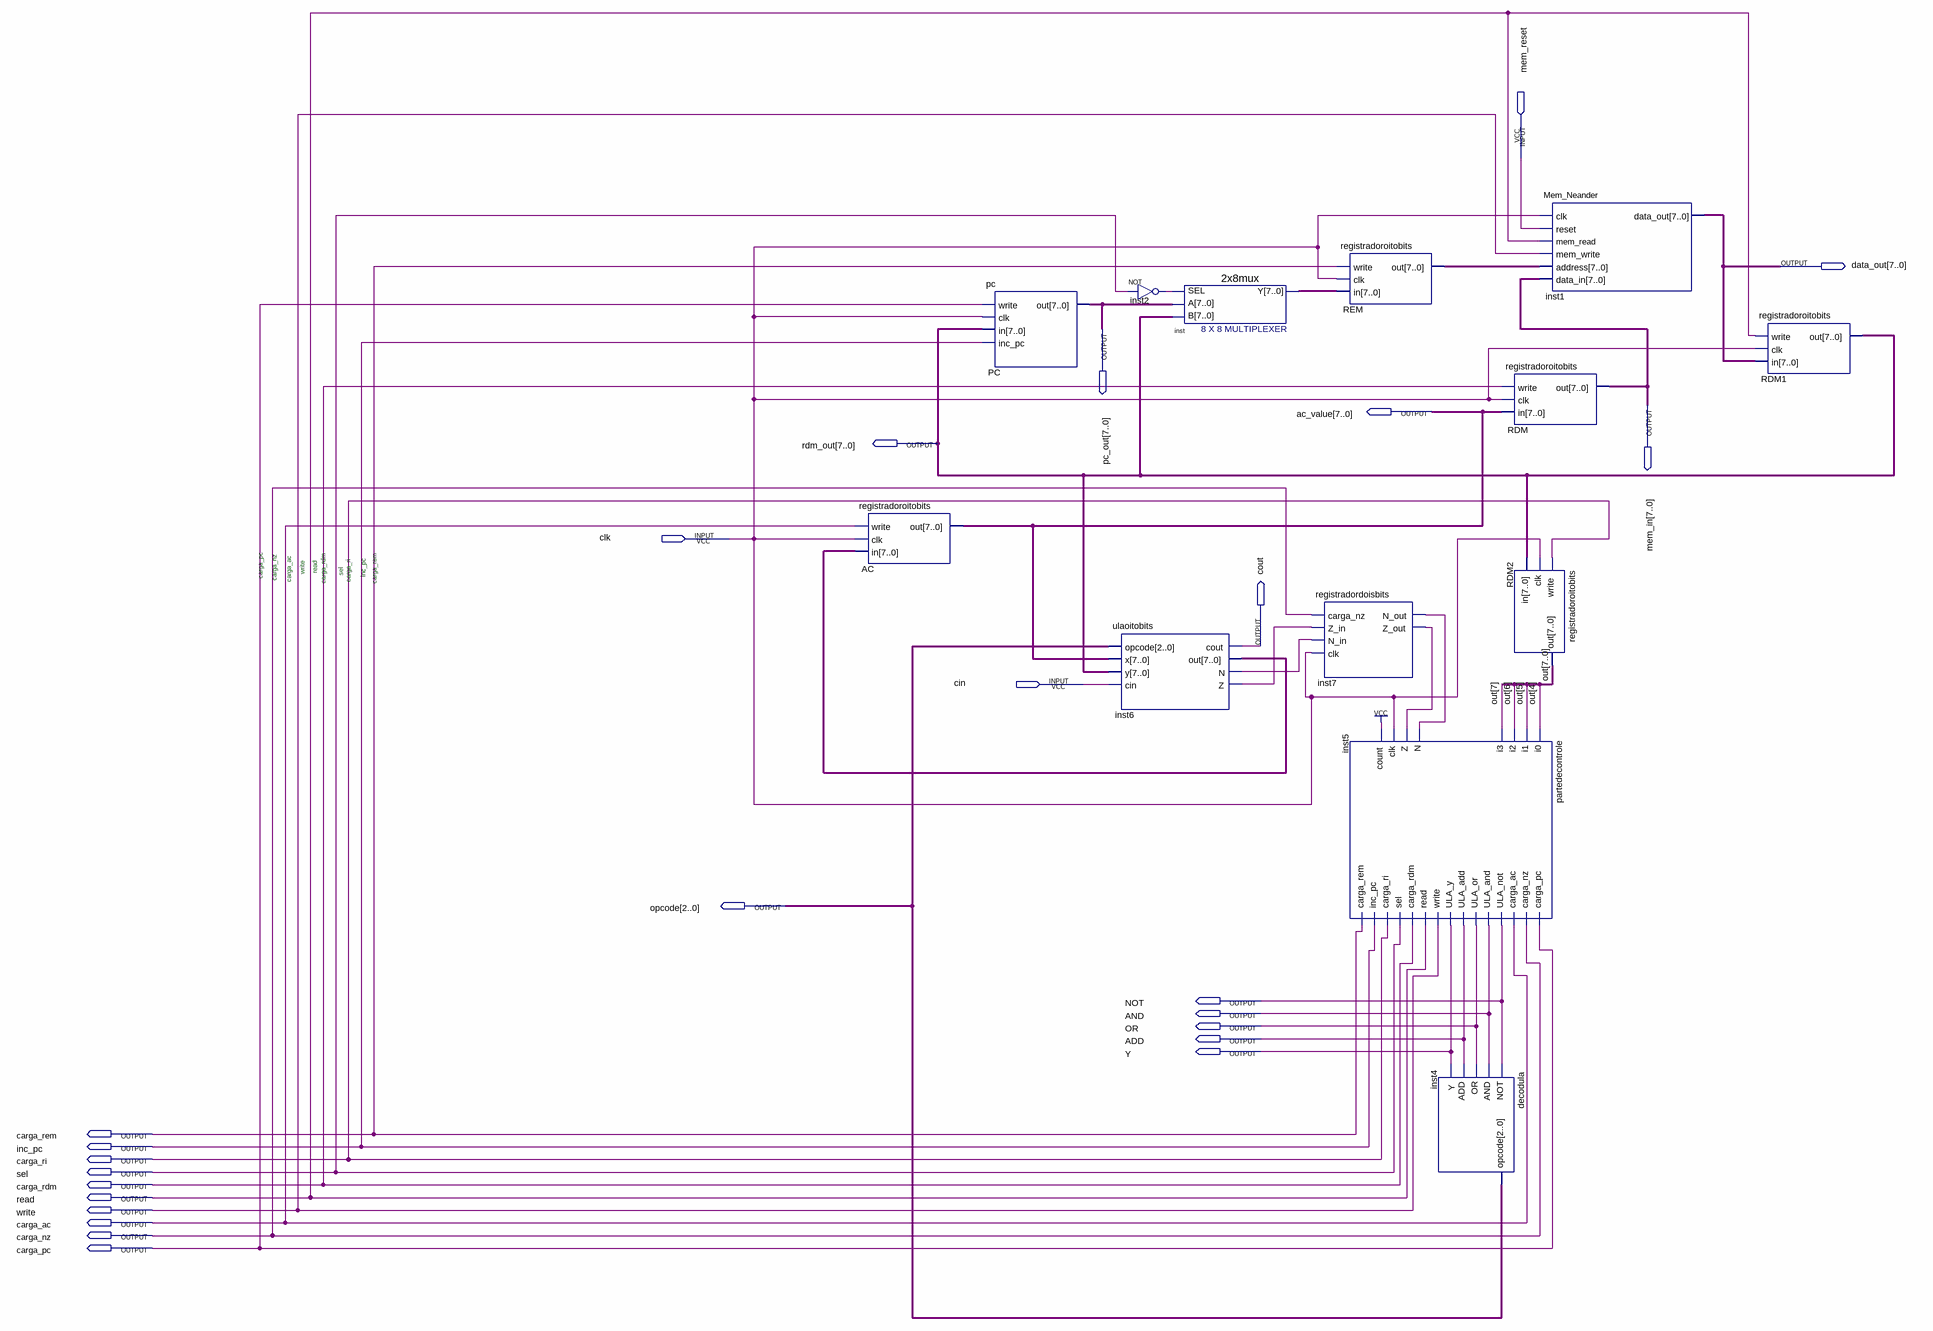
[diagram p0: schematic sheet]
// Quartus schematic parteoperativa.bdf as structural Verilog: 13 symbols, 25 pins
module parteoperativa (
  input  mem_reset,
  input  clk,
  input  cin,
  output [7:0] data_out,
  output [7:0] pc_out,
  output [7:0] mem_in,
  output [7:0] ac_value,
  output [7:0] rdm_out,
  output cout,
  output [2:0] opcode,
  output NOT,
  output AND,
  output OR,
  output ADD,
  output Y,
  output carga_rem,
  output inc_pc,
  output carga_ri,
  output sel,
  output carga_rdm,
  output read,
  output write,
  output carga_ac,
  output carga_nz,
  output carga_pc
);

  wire inst2_out, inst6_n, inst6_z, inst7_n_out, inst7_z_out;
  wire [7:0] inst6_out, inst_y, out, REM_out;

  registradoroitobits AC (.write(carga_ac), .clk(clk), .in(inst6_out), .out(ac_value));
  pc PC (.write(carga_pc), .clk(clk), .in(rdm_out), .inc_pc(inc_pc), .out(pc_out));
  not inst2 (inst2_out, sel);
  ulaoitobits inst6 (
    .opcode(opcode), .x(ac_value), .y(rdm_out), .cin(cin), .cout(cout), .out(inst6_out), .N(inst6_n),
    .Z(inst6_z));
  \2x8mux  inst (.SEL(inst2_out), .A(pc_out), .B(rdm_out), .Y(inst_y));
  registradoroitobits REM (.write(carga_rem), .clk(clk), .in(inst_y), .out(REM_out));
  registradordoisbits inst7 (
    .carga_nz(carga_nz), .Z_in(inst6_z), .N_in(inst6_n), .clk(clk), .N_out(inst7_n_out), .Z_out(inst7_z_out));
  partedecontrole inst5 (
    .i0(out[4]), .i1(out[5]), .i2(out[6]), .i3(out[7]), .N(inst7_n_out), .Z(inst7_z_out), .clk(clk),
    .count(1'b1), .carga_pc(carga_pc), .carga_nz(carga_nz), .carga_ac(carga_ac), .ULA_not(NOT),
    .ULA_and(AND), .ULA_or(OR), .ULA_add(ADD), .ULA_y(Y), .write(write), .read(read), .carga_rdm(carga_rdm),
    .sel(sel), .carga_ri(carga_ri), .inc_pc(inc_pc), .carga_rem(carga_rem));
  decodula inst4 (.AND(AND), .OR(OR), .NOT(NOT), .Y(Y), .ADD(ADD), .opcode(opcode));
  Mem_Neander inst1 (
    .clk(clk), .reset(mem_reset), .mem_read(read), .mem_write(write), .address(REM_out), .data_in(mem_in),
    .data_out(data_out));
  registradoroitobits RDM (.write(carga_rdm), .clk(clk), .in(ac_value), .out(mem_in));
  registradoroitobits RDM2 (.write(carga_ri), .clk(clk), .in(rdm_out), .out(out));
  registradoroitobits RDM1 (.write(read), .clk(clk), .in(data_out), .out(rdm_out));

  // Notes on the sheet:
  //   carga_pc
  //   carga_rdm
  //   carga_rem
  //   carga_nz
  //   carga_ac
  //   carga_ri
  //   inc_pc
  //   write
  //   read
  //   sel
endmodule
